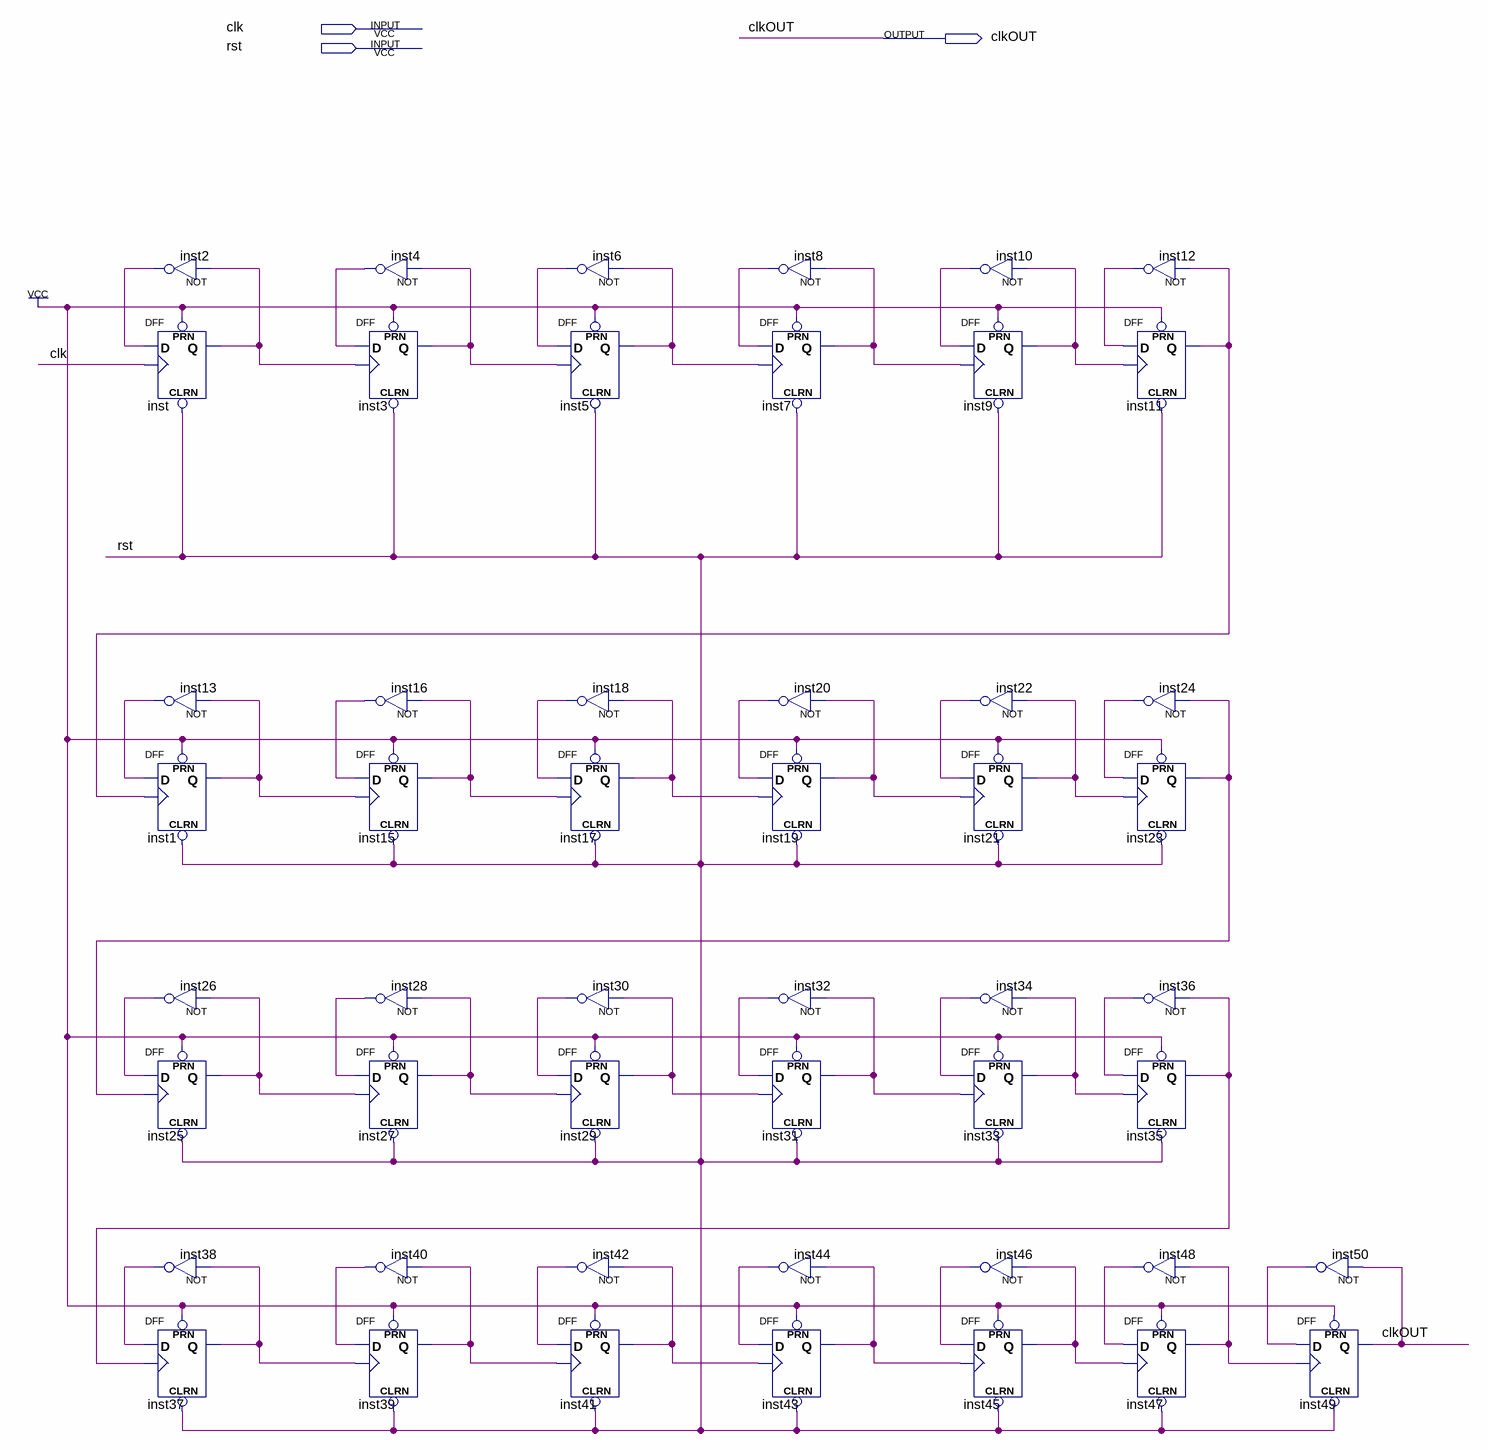
[diagram p0: schematic sheet]
// Quartus schematic div_freq.bdf as structural Verilog: 50 symbols, 3 pins
module div_freq (
  input  clk,
  input  rst,
  output clkOUT
);

  wire inst1_q, inst2_out, inst3_q, inst4_out, inst5_q, inst6_out, inst7_q, inst8_out, inst9_q, inst10_out,
       inst11_q, inst12_out, inst13_out, inst15_q, inst16_out, inst17_q, inst18_out, inst19_q, inst20_out,
       inst21_q, inst22_out, inst23_q, inst24_out, inst25_q, inst26_out, inst27_q, inst28_out, inst29_q,
       inst30_out, inst31_q, inst32_out, inst33_q, inst34_out, inst35_q, inst36_out, inst37_q, inst38_out,
       inst39_q, inst40_out, inst41_q, inst42_out, inst43_q, inst44_out, inst45_q, inst46_out, inst47_q,
       inst48_out, inst50_out, inst_q;

  not inst2 (inst2_out, inst_q);
  DFF inst (.CLRN(rst), .CLK(clk), .D(inst2_out), .PRN(1'b1), .Q(inst_q));
  not inst13 (inst13_out, inst1_q);
  DFF inst1 (.CLRN(rst), .CLK(inst11_q), .D(inst13_out), .PRN(1'b1), .Q(inst1_q));
  not inst26 (inst26_out, inst25_q);
  DFF inst25 (.CLRN(rst), .CLK(inst23_q), .D(inst26_out), .PRN(1'b1), .Q(inst25_q));
  not inst38 (inst38_out, inst37_q);
  DFF inst37 (.CLRN(rst), .CLK(inst35_q), .D(inst38_out), .PRN(1'b1), .Q(inst37_q));
  not inst4 (inst4_out, inst3_q);
  DFF inst3 (.CLRN(rst), .CLK(inst_q), .D(inst4_out), .PRN(1'b1), .Q(inst3_q));
  not inst16 (inst16_out, inst15_q);
  DFF inst15 (.CLRN(rst), .CLK(inst1_q), .D(inst16_out), .PRN(1'b1), .Q(inst15_q));
  not inst28 (inst28_out, inst27_q);
  DFF inst27 (.CLRN(rst), .CLK(inst25_q), .D(inst28_out), .PRN(1'b1), .Q(inst27_q));
  not inst40 (inst40_out, inst39_q);
  DFF inst39 (.CLRN(rst), .CLK(inst37_q), .D(inst40_out), .PRN(1'b1), .Q(inst39_q));
  not inst6 (inst6_out, inst5_q);
  DFF inst5 (.CLRN(rst), .CLK(inst3_q), .D(inst6_out), .PRN(1'b1), .Q(inst5_q));
  not inst18 (inst18_out, inst17_q);
  DFF inst17 (.CLRN(rst), .CLK(inst15_q), .D(inst18_out), .PRN(1'b1), .Q(inst17_q));
  not inst30 (inst30_out, inst29_q);
  DFF inst29 (.CLRN(rst), .CLK(inst27_q), .D(inst30_out), .PRN(1'b1), .Q(inst29_q));
  not inst42 (inst42_out, inst41_q);
  DFF inst41 (.CLRN(rst), .CLK(inst39_q), .D(inst42_out), .PRN(1'b1), .Q(inst41_q));
  not inst8 (inst8_out, inst7_q);
  DFF inst7 (.CLRN(rst), .CLK(inst5_q), .D(inst8_out), .PRN(1'b1), .Q(inst7_q));
  not inst20 (inst20_out, inst19_q);
  DFF inst19 (.CLRN(rst), .CLK(inst17_q), .D(inst20_out), .PRN(1'b1), .Q(inst19_q));
  not inst32 (inst32_out, inst31_q);
  DFF inst31 (.CLRN(rst), .CLK(inst29_q), .D(inst32_out), .PRN(1'b1), .Q(inst31_q));
  not inst44 (inst44_out, inst43_q);
  DFF inst43 (.CLRN(rst), .CLK(inst41_q), .D(inst44_out), .PRN(1'b1), .Q(inst43_q));
  not inst10 (inst10_out, inst9_q);
  DFF inst9 (.CLRN(rst), .CLK(inst7_q), .D(inst10_out), .PRN(1'b1), .Q(inst9_q));
  not inst22 (inst22_out, inst21_q);
  DFF inst21 (.CLRN(rst), .CLK(inst19_q), .D(inst22_out), .PRN(1'b1), .Q(inst21_q));
  not inst34 (inst34_out, inst33_q);
  DFF inst33 (.CLRN(rst), .CLK(inst31_q), .D(inst34_out), .PRN(1'b1), .Q(inst33_q));
  not inst46 (inst46_out, inst45_q);
  DFF inst45 (.CLRN(rst), .CLK(inst43_q), .D(inst46_out), .PRN(1'b1), .Q(inst45_q));
  not inst12 (inst12_out, inst11_q);
  DFF inst11 (.CLRN(rst), .CLK(inst9_q), .D(inst12_out), .PRN(1'b1), .Q(inst11_q));
  not inst24 (inst24_out, inst23_q);
  DFF inst23 (.CLRN(rst), .CLK(inst21_q), .D(inst24_out), .PRN(1'b1), .Q(inst23_q));
  not inst36 (inst36_out, inst35_q);
  DFF inst35 (.CLRN(rst), .CLK(inst33_q), .D(inst36_out), .PRN(1'b1), .Q(inst35_q));
  not inst48 (inst48_out, inst47_q);
  DFF inst47 (.CLRN(rst), .CLK(inst45_q), .D(inst48_out), .PRN(1'b1), .Q(inst47_q));
  not inst50 (inst50_out, clkOUT);
  DFF inst49 (.CLRN(rst), .CLK(inst47_q), .D(inst50_out), .PRN(1'b1), .Q(clkOUT));
endmodule
